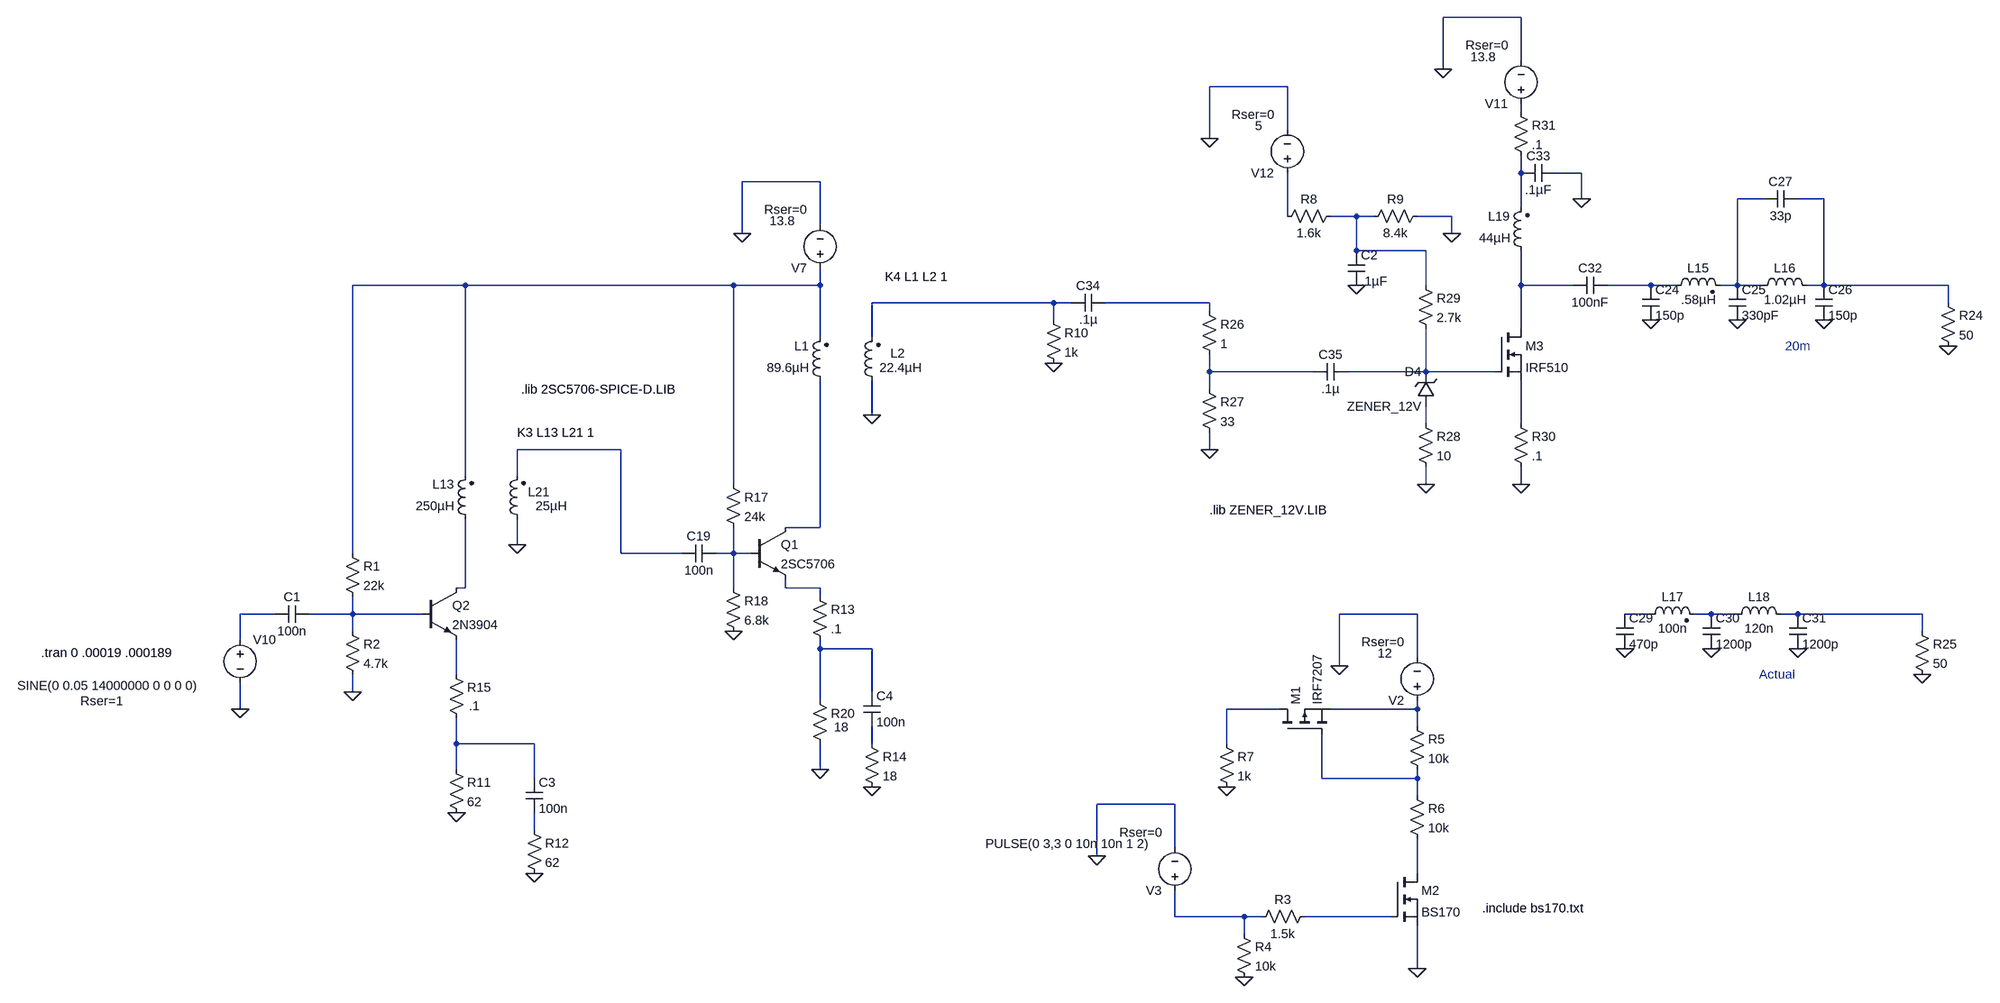
[diagram p0: schematic SSB Amp v2.asc]
SSB Amp v2.asc, the LTspice schematic file:
Version 4
SHEET 1 3764 1240
WIRE 608 -3472 464 -3472
WIRE 608 -3392 608 -3472
WIRE 464 -3376 464 -3472
WIRE 176 -3344 32 -3344
WIRE 608 -3296 608 -3312
WIRE 176 -3264 176 -3344
WIRE 32 -3248 32 -3344
WIRE 608 -3184 608 -3216
WIRE 720 -3184 672 -3184
WIRE -688 -3168 -832 -3168
WIRE 720 -3136 720 -3184
WIRE 1056 -3136 1008 -3136
WIRE 1168 -3136 1120 -3136
WIRE 608 -3120 608 -3184
WIRE 176 -3104 176 -3184
WIRE 304 -3104 256 -3104
WIRE 336 -3104 304 -3104
WIRE 480 -3104 416 -3104
WIRE -688 -3088 -688 -3168
WIRE -832 -3072 -832 -3168
WIRE 480 -3072 480 -3104
WIRE 304 -3040 304 -3104
WIRE 432 -3040 304 -3040
WIRE -1344 -2976 -1552 -2976
WIRE -848 -2976 -1344 -2976
WIRE -688 -2976 -688 -3008
WIRE -688 -2976 -848 -2976
WIRE 432 -2976 432 -3040
WIRE 608 -2976 608 -3040
WIRE 704 -2976 608 -2976
WIRE 848 -2976 768 -2976
WIRE 896 -2976 848 -2976
WIRE 1008 -2976 1008 -3136
WIRE 1008 -2976 976 -2976
WIRE 1056 -2976 1008 -2976
WIRE 1168 -2976 1168 -3136
WIRE 1168 -2976 1136 -2976
WIRE 1536 -2976 1168 -2976
WIRE -256 -2944 -592 -2944
WIRE -224 -2944 -256 -2944
WIRE 32 -2944 -160 -2944
WIRE 1536 -2944 1536 -2976
WIRE 32 -2928 32 -2944
WIRE -256 -2912 -256 -2944
WIRE 608 -2896 608 -2976
WIRE -688 -2880 -688 -2976
WIRE -592 -2880 -592 -2944
WIRE 32 -2816 32 -2848
WIRE 224 -2816 32 -2816
WIRE 432 -2816 432 -2896
WIRE 432 -2816 288 -2816
WIRE 560 -2816 432 -2816
WIRE 32 -2784 32 -2816
WIRE -592 -2736 -592 -2800
WIRE 432 -2720 432 -2752
WIRE 608 -2720 608 -2800
WIRE -1056 -2672 -1248 -2672
WIRE 32 -2672 32 -2704
WIRE -1344 -2624 -1344 -2976
WIRE -1248 -2624 -1248 -2672
WIRE -848 -2608 -848 -2976
WIRE 432 -2608 432 -2640
WIRE 608 -2608 608 -2640
WIRE -688 -2528 -688 -2800
WIRE -688 -2528 -752 -2528
WIRE -1248 -2496 -1248 -2544
WIRE -1552 -2480 -1552 -2976
WIRE -1056 -2480 -1056 -2672
WIRE -944 -2480 -1056 -2480
WIRE -848 -2480 -848 -2528
WIRE -848 -2480 -880 -2480
WIRE -816 -2480 -848 -2480
WIRE -1344 -2416 -1344 -2544
WIRE -1344 -2416 -1360 -2416
WIRE -848 -2416 -848 -2480
WIRE -752 -2416 -752 -2432
WIRE -688 -2416 -752 -2416
WIRE -688 -2400 -688 -2416
WIRE -1696 -2368 -1760 -2368
WIRE -1552 -2368 -1552 -2400
WIRE -1552 -2368 -1632 -2368
WIRE -1424 -2368 -1552 -2368
WIRE 416 -2368 272 -2368
WIRE 848 -2368 800 -2368
WIRE 960 -2368 928 -2368
WIRE 1008 -2368 960 -2368
WIRE 1120 -2368 1088 -2368
WIRE 1488 -2368 1120 -2368
WIRE -1552 -2336 -1552 -2368
WIRE 1488 -2336 1488 -2368
WIRE -1760 -2320 -1760 -2368
WIRE -688 -2304 -688 -2320
WIRE -592 -2304 -688 -2304
WIRE 416 -2288 416 -2368
WIRE 272 -2272 272 -2368
WIRE -1360 -2256 -1360 -2320
WIRE -1552 -2224 -1552 -2256
WIRE -592 -2224 -592 -2304
WIRE -688 -2208 -688 -2304
WIRE -1760 -2192 -1760 -2240
WIRE 160 -2192 64 -2192
WIRE 416 -2192 416 -2208
WIRE 416 -2192 256 -2192
WIRE 416 -2160 416 -2192
WIRE -1360 -2128 -1360 -2176
WIRE -1216 -2128 -1360 -2128
WIRE -592 -2128 -592 -2160
WIRE 64 -2128 64 -2192
WIRE -1360 -2080 -1360 -2128
WIRE -688 -2080 -688 -2128
WIRE -1216 -2064 -1216 -2128
WIRE 240 -2064 240 -2144
WIRE 416 -2064 416 -2080
WIRE 416 -2064 240 -2064
WIRE 416 -2032 416 -2064
WIRE -32 -2016 -176 -2016
WIRE -1216 -1968 -1216 -2000
WIRE -32 -1936 -32 -2016
WIRE -176 -1920 -176 -2016
WIRE 416 -1888 416 -1952
WIRE -32 -1808 -32 -1856
WIRE 96 -1808 -32 -1808
WIRE 128 -1808 96 -1808
WIRE 368 -1808 208 -1808
WIRE 96 -1776 96 -1808
WIRE 416 -1712 416 -1792
FLAG -832 -3072 0
FLAG -848 -2336 0
FLAG -688 -2080 0
FLAG -1760 -2192 0
FLAG 1536 -2864 0
FLAG 848 -2912 0
FLAG 1008 -2912 0
FLAG 1168 -2912 0
FLAG 1488 -2256 0
FLAG 800 -2304 0
FLAG 960 -2304 0
FLAG 1120 -2304 0
FLAG 464 -3376 0
FLAG 720 -3136 0
FLAG 32 -2672 0
FLAG 432 -2608 0
FLAG 608 -2608 0
FLAG 32 -3248 0
FLAG -1552 -2224 0
FLAG 416 -1712 0
FLAG 96 -1696 0
FLAG 272 -2272 0
FLAG -176 -1920 0
FLAG 64 -2048 0
FLAG 480 -3072 0
FLAG 304 -2976 0
FLAG -256 -2832 0
FLAG -1360 -2000 0
FLAG -1216 -1888 0
FLAG -1248 -2496 0
FLAG -592 -2048 0
FLAG -592 -2736 0
SYMBOL npn -816 -2528 R0
SYMATTR InstName Q1
SYMATTR Value 2SC5706
SYMBOL voltage -688 -2992 R180
WINDOW 123 0 0 Left 0
WINDOW 39 24 124 Left 2
WINDOW 3 46 103 Left 2
SYMATTR SpiceLine Rser=0
SYMATTR Value 13.8
SYMATTR InstName V7
SYMBOL npn -1424 -2416 R0
SYMATTR InstName Q2
SYMATTR Value 2N3904
SYMBOL cap -880 -2496 R90
WINDOW 0 0 32 VBottom 2
WINDOW 3 32 32 VTop 2
SYMATTR InstName C19
SYMATTR Value 100n
SYMBOL res -864 -2624 R0
SYMATTR InstName R17
SYMATTR Value 24k
SYMBOL res -864 -2432 R0
SYMATTR InstName R18
SYMATTR Value 6.8k
SYMBOL ind2 -1328 -2528 R180
WINDOW 0 36 80 Left 2
WINDOW 3 36 40 Left 2
SYMATTR InstName L13
SYMATTR Value 250µH
SYMATTR Type ind
SYMBOL res -704 -2224 R0
WINDOW 3 42 65 Left 2
SYMATTR Value 18
SYMATTR InstName R20
SYMBOL voltage -1760 -2336 R0
WINDOW 123 0 0 Left 0
WINDOW 39 -295 129 Left 2
WINDOW 3 -412 101 Left 2
SYMATTR SpiceLine Rser=1
SYMATTR Value SINE(0 0.05 14000000 0 0 0 0)
SYMATTR InstName V10
SYMBOL res 1520 -2960 R0
SYMATTR InstName R24
SYMATTR Value 50
SYMBOL cap 832 -2976 R0
SYMATTR InstName C24
SYMATTR Value 150p
SYMBOL cap 992 -2976 R0
SYMATTR InstName C25
SYMATTR Value 330pF
SYMBOL cap 1152 -2976 R0
SYMATTR InstName C26
SYMATTR Value 150p
SYMBOL ind2 880 -2960 R270
WINDOW 0 32 56 VTop 2
WINDOW 3 5 56 VBottom 2
SYMATTR InstName L15
SYMATTR Value .58µH
SYMATTR Type ind
SYMBOL ind 1040 -2960 R270
WINDOW 0 32 56 VTop 2
WINDOW 3 5 56 VBottom 2
SYMATTR InstName L16
SYMATTR Value 1.02µH
SYMBOL cap 1120 -3152 R90
WINDOW 0 0 32 VBottom 2
WINDOW 3 32 32 VTop 2
SYMATTR InstName C27
SYMATTR Value 33p
SYMBOL res 1472 -2352 R0
SYMATTR InstName R25
SYMATTR Value 50
SYMBOL cap 784 -2368 R0
SYMATTR InstName C29
SYMATTR Value 470p
SYMBOL cap 944 -2368 R0
SYMATTR InstName C30
SYMATTR Value 1200p
SYMBOL cap 1104 -2368 R0
SYMATTR InstName C31
SYMATTR Value 1200p
SYMBOL ind2 832 -2352 R270
WINDOW 0 32 56 VTop 2
WINDOW 3 5 56 VBottom 2
SYMATTR InstName L17
SYMATTR Value 100n
SYMATTR Type ind
SYMBOL ind 992 -2352 R270
WINDOW 0 32 56 VTop 2
WINDOW 3 5 56 VBottom 2
SYMATTR InstName L18
SYMATTR Value 120n
SYMBOL voltage 608 -3296 R180
WINDOW 123 0 0 Left 0
WINDOW 39 24 124 Left 2
WINDOW 3 46 103 Left 2
SYMATTR SpiceLine Rser=0
SYMATTR Value 13.8
SYMATTR InstName V11
SYMBOL ind2 624 -3024 R180
WINDOW 0 36 80 Left 2
WINDOW 3 36 40 Left 2
SYMATTR InstName L19
SYMATTR Value 44µH
SYMATTR Type ind
SYMBOL cap 768 -2992 R90
WINDOW 0 0 32 VBottom 2
WINDOW 3 32 32 VTop 2
SYMATTR InstName C32
SYMATTR Value 100nF
SYMBOL ind2 -1232 -2528 R180
WINDOW 0 -45 66 Left 2
WINDOW 3 -76 40 Left 2
SYMATTR InstName L21
SYMATTR Value 25µH
SYMATTR Type ind
SYMBOL cap 672 -3200 R90
WINDOW 0 0 32 VBottom 2
WINDOW 3 32 32 VTop 2
SYMATTR InstName C33
SYMATTR Value .1µF
SYMBOL cap -160 -2960 R90
WINDOW 0 0 32 VBottom 2
WINDOW 3 32 32 VTop 2
SYMATTR InstName C34
SYMATTR Value .1µ
SYMBOL zener 448 -2752 R180
WINDOW 0 24 64 Left 2
WINDOW 3 24 0 Left 2
SYMATTR InstName D4
SYMATTR Value ZENER_12V
SYMBOL res 16 -2944 R0
SYMATTR InstName R26
SYMATTR Value 1
SYMBOL res 16 -2800 R0
SYMATTR InstName R27
SYMATTR Value 33
SYMBOL cap 288 -2832 R90
WINDOW 0 0 32 VBottom 2
WINDOW 3 32 32 VTop 2
SYMATTR InstName C35
SYMATTR Value .1µ
SYMBOL res 416 -2736 R0
SYMATTR InstName R28
SYMATTR Value 10
SYMBOL nmos 560 -2896 R0
SYMATTR InstName M3
SYMATTR Value IRF510
SYMBOL res 416 -2992 R0
SYMATTR InstName R29
SYMATTR Value 2.7k
SYMBOL voltage 176 -3168 R180
WINDOW 123 0 0 Left 0
WINDOW 39 24 124 Left 2
WINDOW 3 46 103 Left 2
SYMATTR SpiceLine Rser=0
SYMATTR Value 5
SYMATTR InstName V12
SYMBOL res 592 -2736 R0
SYMATTR InstName R30
SYMATTR Value .1
SYMBOL res 592 -3312 R0
SYMATTR InstName R31
SYMATTR Value .1
SYMBOL cap -1632 -2384 R90
WINDOW 0 0 32 VBottom 2
WINDOW 3 32 32 VTop 2
SYMATTR InstName C1
SYMATTR Value 100n
SYMBOL res -1568 -2496 R0
SYMATTR InstName R1
SYMATTR Value 22k
SYMBOL res -1568 -2352 R0
SYMATTR InstName R2
SYMATTR Value 4.7k
SYMBOL nmos 368 -1888 R0
SYMATTR InstName M2
SYMATTR Value BS170
SYMATTR Prefix X
SYMBOL res 224 -1824 R90
WINDOW 0 0 56 VBottom 2
WINDOW 3 32 56 VTop 2
SYMATTR InstName R3
SYMATTR Value 1.5k
SYMBOL res 80 -1792 R0
SYMATTR InstName R4
SYMATTR Value 10k
SYMBOL voltage 416 -2192 R180
WINDOW 123 0 0 Left 0
WINDOW 39 24 124 Left 2
WINDOW 3 46 103 Left 2
SYMATTR SpiceLine Rser=0
SYMATTR Value 12
SYMATTR InstName V2
SYMBOL res 400 -2176 R0
SYMATTR InstName R5
SYMATTR Value 10k
SYMBOL res 400 -2048 R0
SYMATTR InstName R6
SYMATTR Value 10k
SYMBOL voltage -32 -1840 R180
WINDOW 123 0 0 Left 0
WINDOW 39 24 124 Left 2
WINDOW 3 46 103 Left 2
SYMATTR SpiceLine Rser=0
SYMATTR Value PULSE(0 3,3 0 10n 10n 1 2)
SYMATTR InstName V3
SYMBOL pmos 160 -2144 R270
SYMATTR InstName M1
SYMATTR Value IRF7207
SYMBOL res 48 -2144 R0
SYMATTR InstName R7
SYMATTR Value 1k
SYMBOL res 272 -3120 R90
WINDOW 0 0 56 VBottom 2
WINDOW 3 32 56 VTop 2
SYMATTR InstName R8
SYMATTR Value 1.6k
SYMBOL res 432 -3120 R90
WINDOW 0 0 56 VBottom 2
WINDOW 3 32 56 VTop 2
SYMATTR InstName R9
SYMATTR Value 8.4k
SYMBOL res -272 -2928 R0
SYMATTR InstName R10
SYMATTR Value 1k
SYMBOL cap 288 -3040 R0
SYMATTR InstName C2
SYMATTR Value .1µF
SYMBOL res -1376 -2096 R0
SYMATTR InstName R11
SYMATTR Value 62
SYMBOL res -1232 -1984 R0
SYMATTR InstName R12
SYMATTR Value 62
SYMBOL cap -1232 -2064 R0
SYMATTR InstName C3
SYMATTR Value 100n
SYMBOL res -608 -2144 R0
SYMATTR InstName R14
SYMATTR Value 18
SYMBOL cap -608 -2224 R0
SYMATTR InstName C4
SYMATTR Value 100n
SYMBOL ind2 -672 -2784 R180
WINDOW 0 36 80 Left 2
WINDOW 3 36 40 Left 2
SYMATTR InstName L1
SYMATTR Value 89.6µH
SYMATTR Type ind
SYMBOL ind2 -576 -2784 R180
WINDOW 0 -45 66 Left 2
WINDOW 3 -76 40 Left 2
SYMATTR InstName L2
SYMATTR Value 22.4µH
SYMATTR Type ind
SYMBOL res -704 -2416 R0
SYMATTR InstName R13
SYMATTR Value .1
SYMBOL res -1376 -2272 R0
WINDOW 3 39 74 Left 2
SYMATTR Value .1
SYMATTR InstName R15
TEXT -1240 -2784 Left 2 !.lib 2SC5706-SPICE-D.LIB
TEXT 1096 -2864 Left 2 ;20m
TEXT 1048 -2256 Left 2 ;Actual
TEXT -568 -2992 Left 2 !K4 L1 L2 1
TEXT -2128 -2296 Left 2 !.tran 0 .00019 .000189
TEXT 536 -1824 Left 2 !.include bs170.txt
TEXT -1248 -2704 Left 2 !K3 L13 L21 1
TEXT 32 -2560 Left 2 !.lib ZENER_12V.LIB

The netlist it stands for:
* SSB Amp v2.asc
Q1 N017 N018 N020 0 2SC5706
V7 N007 0 13.8 Rser=0
Q2 N019 N022 N027 0 2N3904
C19 N018 N016 100n
R17 N007 N018 24k
R18 N018 0 6.8k
L13 N019 N007 250µH
R20 N026 0 18
V10 N021 0 SINE(0 0.05 14000000 0 0 0 0) Rser=1
R24 N004 0 50
C24 N009 0 150p
C25 N003 0 330pF
C26 N004 0 150p
L15 N009 N003 .58µH
L16 N003 N004 1.02µH
C27 N004 N003 33p
R25 N025 0 50
C29 N023 0 470p
C30 N024 0 1200p
C31 N025 0 1200p
L17 N023 N024 100n
L18 N024 N025 120n
V11 N001 0 13.8 Rser=0
L19 N008 N002 44µH
C32 N009 N008 100nF
L21 0 N016 25µH
C33 0 N002 .1µF
C34 N011 N010 .1µ
D4 N014 N013 ZENER_12V
R26 N011 N012 1
R27 N012 0 33
C35 N013 N012 .1µ
R28 N014 0 10
M3 N008 N013 N015 N015 IRF510
R29 N006 N013 2.7k
V12 N005 0 5 Rser=0
R30 N015 0 .1
R31 N001 N002 .1
C1 N022 N021 100n
R1 N007 N022 22k
R2 N022 0 4.7k
XM2 N034 N036 0 BS170  ; pins D G S
R3 N036 N035 1.5k
R4 N035 0 10k
V2 N029 0 12 Rser=0
R5 N029 N032 10k
R6 N032 N034 10k
V3 N035 0 PULSE(0 3,3 0 10n 10n 1 2) Rser=0
M1 N028 N032 N029 N029 IRF7207
R7 N028 0 1k
R8 N006 N005 1.6k
R9 0 N006 8.4k
R10 N010 0 1k
C2 N006 0 .1µF
R11 N030 0 62
R12 N033 0 62
C3 N030 N033 100n
R14 N031 0 18
C4 N026 N031 100n
L1 N017 N007 89.6µH
L2 0 N010 22.4µH
R13 N020 N026 .1
R15 N027 N030 .1
.model D D
.lib standard.dio
.model NPN NPN
.model PNP PNP
.lib standard.bjt
.model NMOS NMOS
.model PMOS PMOS
.lib standard.mos
.lib 2SC5706-SPICE-D.LIB
* 20m
* Actual
K4 L1 L2 1
.tran 0 .00019 .000189
.include bs170.txt
K3 L13 L21 1
.lib ZENER_12V.LIB
.backanno
.end